# Altium schematic sheet EPM3032_breakout.SchDoc
size A
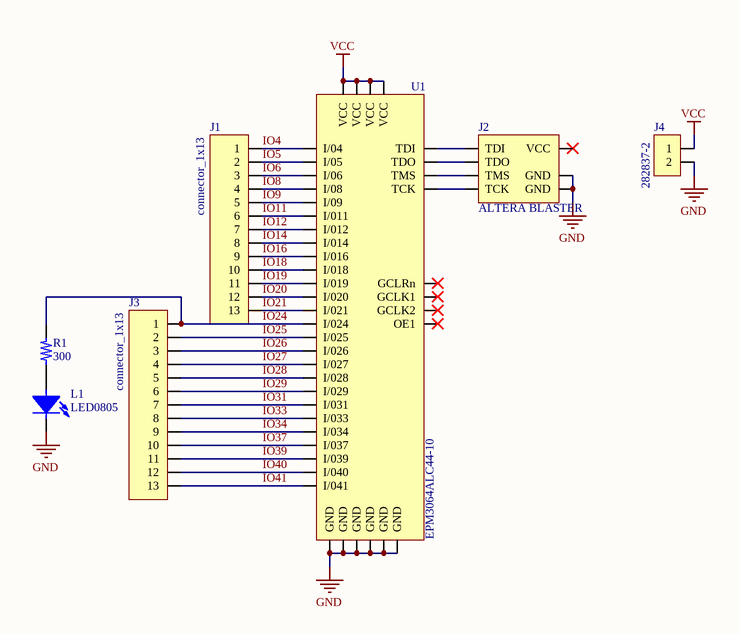
[diagram p0: EPM3032_breakout.SchDoc]

## Parts
J1  connector_1x13  [CONECTOR_1X13]
J2  ALTERA BLASTER  [ALTERA_BLASTER]
J3  connector_1x13  [CONECTOR_1X13]
J4  282837-2  [282837-2]
L1  LED0805  [LED0805]  (no BOM)
R1  300  [R0805]
U1  EPM3064ALC44-10  [PLCC44_DIP]

## Nets
GND: J2.2(GND) J2.10(GND) J4.2 L1.1(C) U1.10(GND) U1.17(GND) U1.22(GND) U1.30(GND) U1.36(GND) U1.42(GND)
VCC: J4.1 U1.3(VCC) U1.15(VCC) U1.23(VCC) U1.35(VCC)
IO4: J1.1 U1.4(I/04)
IO5: J1.2 U1.5(I/05)
IO6: J1.3 U1.6(I/06)
IO8: J1.4 U1.8(I/08)
IO9: J1.5 U1.9(I/09)
IO11: J1.6 U1.11(I/011)
IO12: J1.7 U1.12(I/012)
IO14: J1.8 U1.14(I/014)
IO16: J1.9 U1.16(I/016)
IO18: J1.10 U1.18(I/018)
IO19: J1.11 U1.19(I/019)
IO20: J1.12 U1.20(I/020)
IO21: J1.13 U1.21(I/021)
IO24: J3.1 R1.2 U1.24(I/024)
IO25: J3.2 U1.25(I/025)
IO26: J3.3 U1.26(I/026)
IO27: J3.4 U1.27(I/027)
IO28: J3.5 U1.28(I/028)
IO29: J3.6 U1.29(I/029)
IO31: J3.7 U1.31(I/031)
IO33: J3.8 U1.33(I/033)
IO34: J3.9 U1.34(I/034)
IO37: J3.10 U1.37(I/037)
IO39: J3.11 U1.39(I/039)
IO40: J3.12 U1.40(I/040)
IO41: J3.13 U1.41(I/041)
NetJ2_1: J2.1(TCK) U1.32(TCK)
NetJ2_3: J2.3(TDO) U1.38(TDO)
NetJ2_5: J2.5(TMS) U1.13(TMS)
NetJ2_9: J2.9(TDI) U1.7(TDI)
NetL1_2: L1.2(A) R1.1

Not connected (* = marked no-connect by the designer): J2 4(VCC)*; U1 1(GCLRn)* 2(GCLK2)* 43(GCLK1)* 44(OE1)*

## Library data of the parts
J2 = ALTERA_JTAG
J4 = 282837-2: Conn Terminal Blocks F 2 POS 5.08mm Solder ST Thru-Hole 13.5A/Contact; Manufacturer: TE Connectivity; Plating: Brass; Number of Poles: 2; Gender: Female; Current Rating: 13.5A; Voltage Rating: 250V; Number of Levels: 1; Voltage: 300V; Connector Type: Receptacle; Closed End: No (Without); Interlock: Yes (With); Wire Gauge (Max): 28AWG; Wire Gauge (Min): 16AWG; Wire/Cable Gauge: 30AWG; Thread Size: M3; Tail Length: 3.5mm; Approvals: UL; Supplier 1: Digi-Key; Manufacturer Part Number: 282837-2; Stock 1: 133598; RoHS: Yes; Mount: Through Hole; Contact Material: Brass; Contact Plating: Tin; Color: Green; Housing Color: Green; Housing Material: Polyamide; Number of Rows: 1; Packaging: Bulk; Package Quantity: 300; Max Current Rating: 13.5A; Max Voltage Rating (AC): 250V; Number of Positions Per Level: 2; Current: 13.5A; Termination: Solder; Number of Positions: 2; Number of Contacts: 2; Max Supply Voltage (AC): 250V; Number of Circuits: 2; Orientation: Straight; Voltage Rating (AC): 250V; Screw Flange: No (Without); Screwless Terminal Block: No (Without); Side Stackable: Yes (With); Length: 10.76mm; Height: 11.5mm; Width: 11.5mm; Pitch: 5.08mm; Depth: 8.2mm; Radiation Hardening: No; REACH SVHC: Unknown; Flammability Rating: UL94 V-0; Lead Free: Lead Free; ELV: Compliant; ComponentLink1URL: https://datasheet.ciiva.com/819/eng-cs-1308389-eurostyle-terminal-blocks-0607-819104.pdf?src-supplier=Avnet; ComponentLink1Description: https://datasheet.ciiva.com/819/eng-cs-1308389-eurostyle-terminal-blocks-0607-819104.pdf?src-supplier=Avnet; ComponentLink2URL: https://datasheet.ciiva.com/16305/eng-cs-1308389-eurostyle-terminal-blocks-0607-16305248.pdf?src-supplier=Future+Electronics; ComponentLink2Description: https://datasheet.ciiva.com/16305/eng-cs-1308389-eurostyle-terminal-blocks-0607-16305248.pdf?src-supplier=Future+Electronics; ComponentLink3URL: https://datasheet.ciiva.com/19467/750688-19467564.pdf?src-supplier=Jameco; ComponentLink3Description: https://datasheet.ciiva.com/19467/750688-19467564.pdf?src-supplier=Jameco; ComponentLink4URL: https://datasheet.ciiva.com/11758/0900766b80e7dc97-11758677.pdf?src-supplier=RSComponents; ComponentLink4Description: https://datasheet.ciiva.com/11758/0900766b80e7dc97-11758677.pdf?src-supplier=RSComponents; ComponentLink5URL: https://datasheet.ciiva.com/7978/1650926-7978569.pdf?src-supplier=Element14; ComponentLink5Description: https://datasheet.ciiva.com/7978/1650926-7978569.pdf?src-supplier=Element14; ComponentLink6URL: https://datasheet.ciiva.com/14606/70086281-14606908.pdf?src-supplier=Allied+Electronics; ComponentLink6Description: https://datasheet.ciiva.com/14606/70086281-14606908.pdf?src-supplier=Allied+Electronics; ComponentLink7URL: https://datasheet.ciiva.com/30084/eng-cs-1308389-eurostyle-terminal-blocks-0607-30084269.pdf?src-supplier=Onlinecomponents.com; ComponentLink7Description: https://datasheet.ciiva.com/30084/eng-cs-1308389-eurostyle-terminal-blocks-0607-30084269.pdf?src-supplier=Onlinecomponents.com; ComponentLink8URL: https://datasheet.ciiva.com/823/eng-cd-282837-g3-823439.pdf?src-supplier=Digi-Key; ComponentLink8Description: https://datasheet.ciiva.com/823/eng-cd-282837-g3-823439.pdf?src-supplier=Digi-Key; ComponentLink9URL: https://datasheet.ciiva.com/16649/eng-cs-1308389-eurostyle-terminal-blocks-0607-16649391.pdf?src-supplier=Avnet+Europe; ComponentLink9Description: https://datasheet.ciiva.com/16649/eng-cs-1308389-eurostyle-terminal-blocks-0607-16649391.pdf?src-supplier=Avnet+Europe; ComponentLink10URL: https://datasheet.ciiva.com/18620/eng-cd-282837-g3-18620917.pdf?src-supplier=Digi-Key; ComponentLink10Description: https://datasheet.ciiva.com/18620/eng-cd-282837-g3-18620917.pdf?src-supplier=Digi-Key; Supplier Part Number 1: A113320-ND; Pricing 1: 1 = 1.04000, 10 = 0.64700, 25 = 0.55400, 50 = 0.49780, 100 = 0.48750, 250 = 0.41492, 500 = 0.39416, 1000 = 0.35267, 5000 = 0.27591 (USD)
L1 = LED0805: LED0805 any color
R1 = R0805
U1 = EPM3064ALC44-10: IC CPLD 64MC 10NS 44PLCC; Manufacturer: Intel Altera; Number of Programmable I/O: 34; Operating Supply Voltage: 3.3V; Speed Grade: 10; Number of Gates: 1250; Min Supply Voltage: 3V; Max Supply Voltage: 3.6V; Frequency: 125MHz; Number of Logic Blocks (LABs): 4; Number of Macrocells: 64; Memory Type: EEPROM; Max Frequency: 222.2MHz; Supplier 1: Digi-Key; Manufacturer Part Number: EPM3064ALC44-10; Stock 1: 0; RoHS: Yes; Mount: Surface Mount; Case/Package: PLCC; Number of Pins: 44; Min Operating Temperature: 0°C; Max Operating Temperature: 70°C; Packaging: Rail/Tube; Propagation Delay: 10ns; Package Quantity: 130; Number of I/Os: 34; Number of Logic Elements/Cells: 4; Turn-On Delay Time: 10ns; Length: 16.59mm; Height: 3.81mm; Width: 16.59mm; Radiation Hardening: No; Lead Free: Contains Lead; ComponentLink1URL: https://datasheet.ciiva.com/29887/1723147-29887635.pdf?src-supplier=Jameco; ComponentLink1Description: https://datasheet.ciiva.com/29887/1723147-29887635.pdf?src-supplier=Jameco; ComponentLink2URL: https://datasheet.ciiva.com/15102/getdatasheetpartid-224088-15102743.pdf?src-supplier=Verical; ComponentLink2Description: https://datasheet.ciiva.com/15102/getdatasheetpartid-224088-15102743.pdf?src-supplier=Verical; ComponentLink3URL: https://datasheet.ciiva.com/1406/m3000a-1406963.pdf?src-supplier=Digi-Key; ComponentLink3Description: https://datasheet.ciiva.com/1406/m3000a-1406963.pdf?src-supplier=Digi-Key